# EAGLE design clockv2 (EAGLE 6.4)
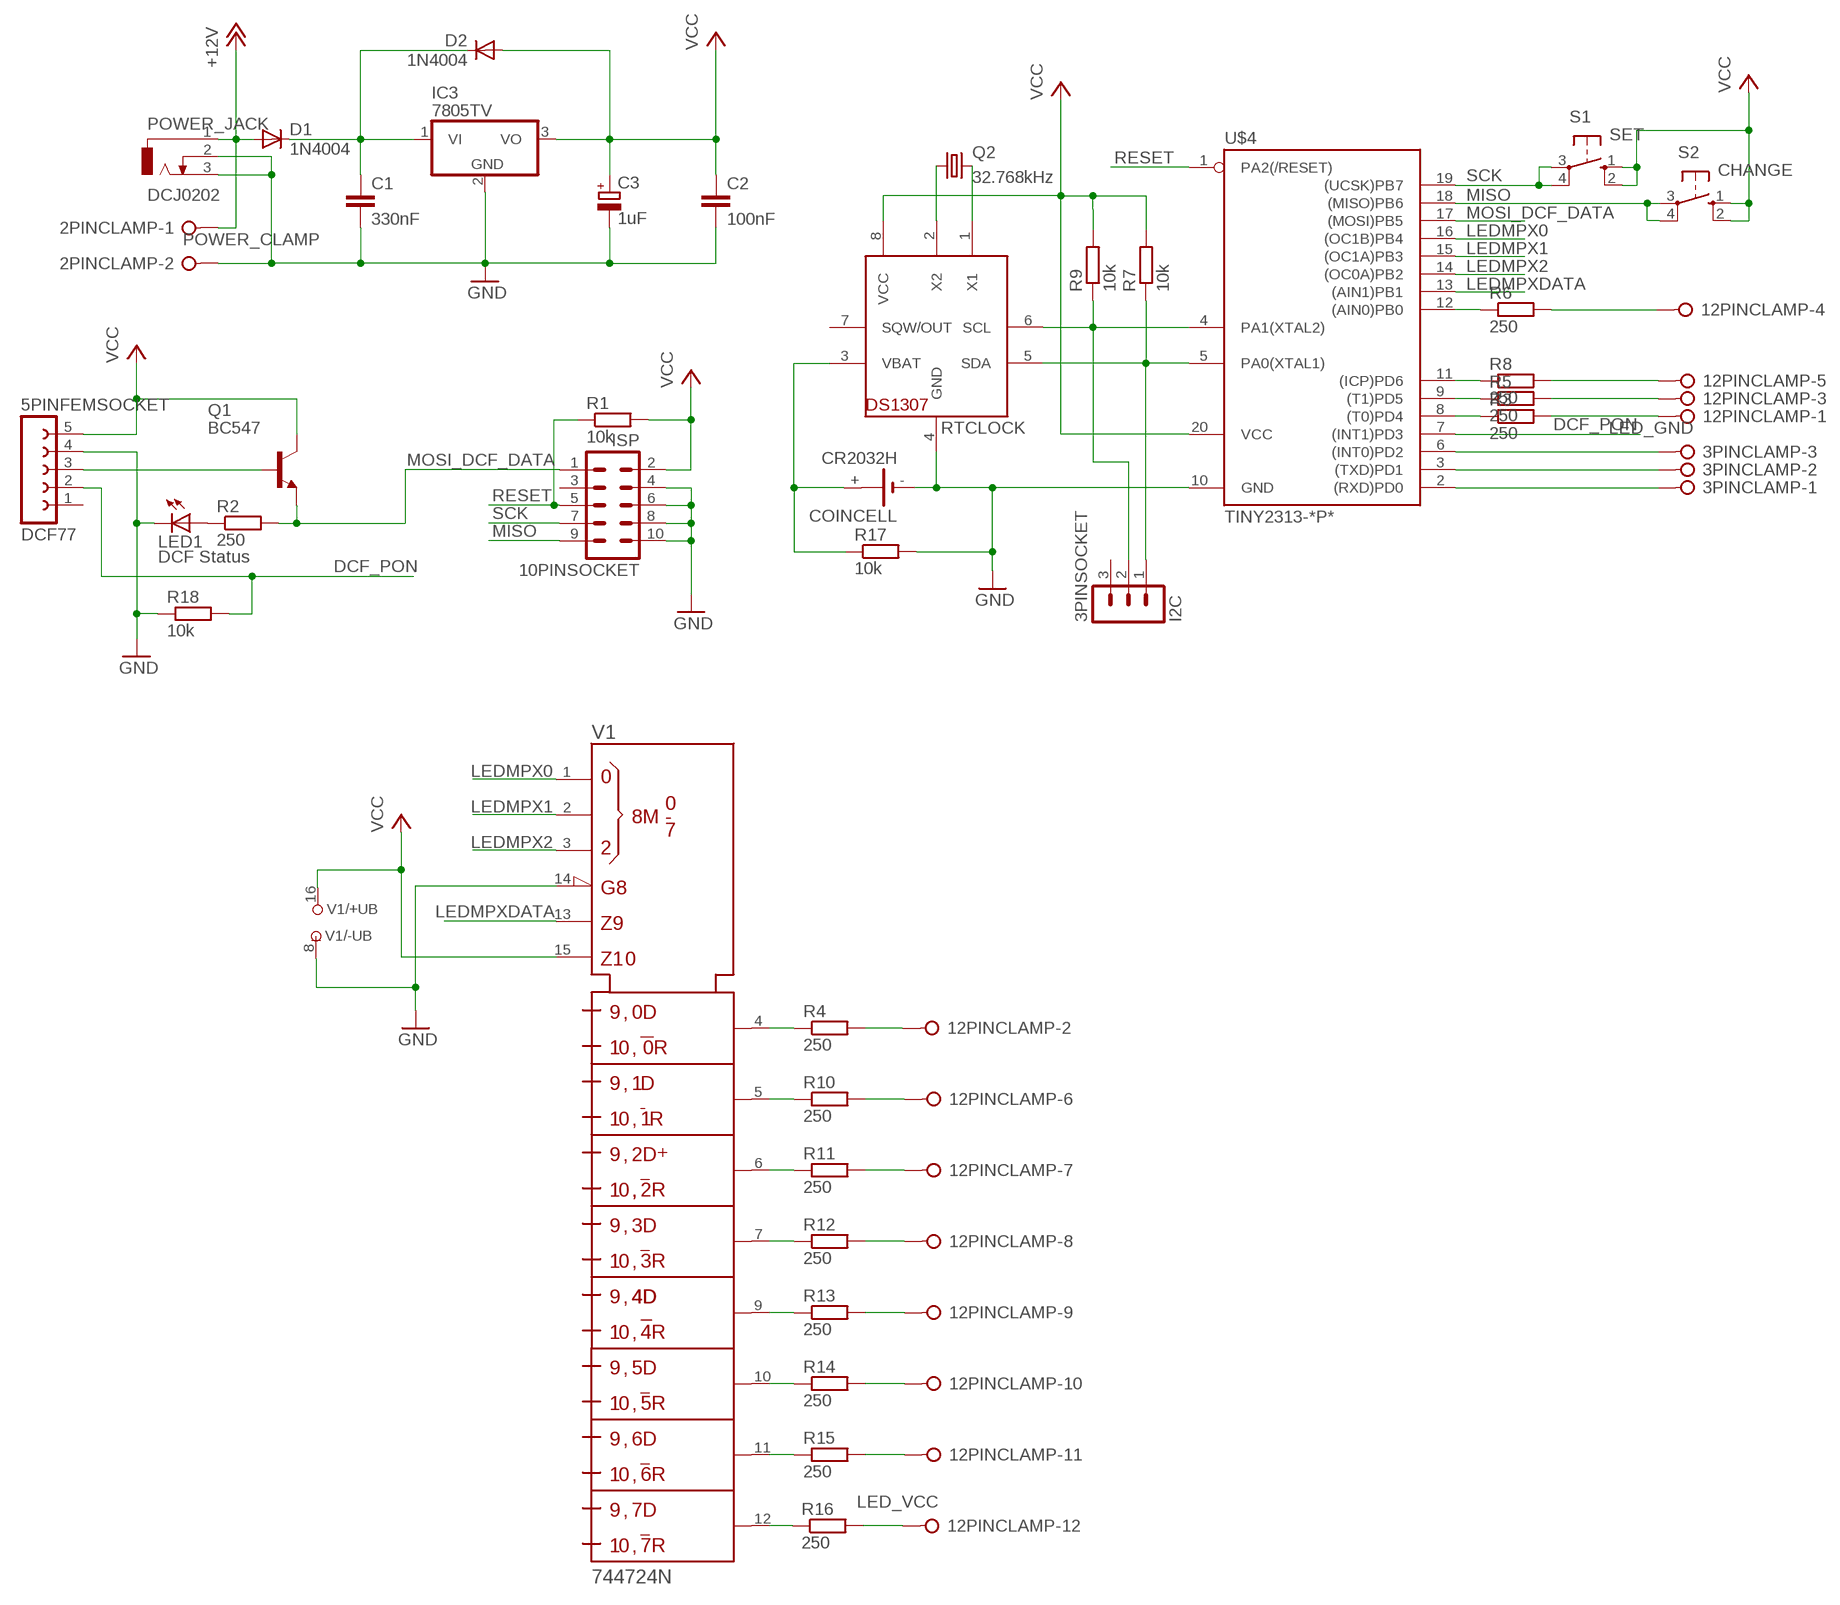
[diagram p0: schematic, sheet 1]

## Parts
2PINCLAMP  POWER_CLAMP  W237-02P  [W237-132]
3PINCLAMP  LED_GND  W237-03P  [W237-133]
3PINSOCKET  I2C  MA03-1  [MA03-1]
5PINFEMSOCKET  DCF77  FE05-1  [FE05-1]
10PINSOCKET  ISP  ML10  [ML10]
12PINCLAMP  LED_VCC  W237-12P  [W237-12P]
C1  330nF  C-EU050-025X075  [C050-025X075]
C2  100nF  C-EU050-025X075  [C050-025X075]
C3  1uF  CPOL-EUE2-4  [E2-4]
COINCELL  CR2032H  [CR2032H]
D1  1N4004  [DO41-10]
D2  1N4004  [DO41-10]
IC3  7805TV  [TO220V]
LED1  DCF Status  LED5MM  [LED5MM]
POWER_JACK  DCJ0202  [DCJ0202]
Q1  BC547  [TO92]
Q2  32.768kHz  CRYSTALTC38H  [TC38H]
R1  10k  R-EU_0204/5  [0204/5]
R2  250  R-EU_0204/5  [0204/5]
R3  250  R-EU_0204/5  [0204/5]
R4  250  R-EU_0204/5  [0204/5]
R5  250  R-EU_0204/5  [0204/5]
R6  250  R-EU_0204/5  [0204/5]
R7  10k  R-EU_0204/5  [0204/5]
R8  250  R-EU_0204/5  [0204/5]
R9  10k  R-EU_0204/5  [0204/5]
R10  250  R-EU_0204/5  [0204/5]
R11  250  R-EU_0204/5  [0204/5]
R12  250  R-EU_0204/5  [0204/5]
R13  250  R-EU_0204/5  [0204/5]
R14  250  R-EU_0204/5  [0204/5]
R15  250  R-EU_0204/5  [0204/5]
R16  250  R-EU_0204/5  [0204/5]
R17  10k  R-EU_0204/5  [0204/5]
R18  10k  R-EU_0204/5  [0204/5]
RTCLOCK  DS1307  [DIL08]
S1  SET  10-XX  [B3F-10XX]
S2  CHANGE  10-XX  [B3F-10XX]
U$4  TINY2313-*P*  [DIL20]
V1  744724N  [DIL16]

## Nets
+12V: 2PINCLAMP.1 D1.A POWER_JACK.1
DCF_PON: 5PINFEMSOCKET.2 R18.2 U$4.7((INT1)PD3)
GND: 2PINCLAMP.2 5PINFEMSOCKET.4 10PINSOCKET.4 10PINSOCKET.6 10PINSOCKET.8 10PINSOCKET.10 C1.2 C2.2 C3.- COINCELL.- IC3.2(GND) LED1.K(C) POWER_JACK.2 POWER_JACK.3 R17.2 R18.1 RTCLOCK.4(GND) U$4.10(GND) V1.8(-UB) V1.14(!G)
LEDMPX0: U$4.16((OC1B)PB4) V1.1(S0)
LEDMPX1: U$4.15((OC1A)PB3) V1.2(S1)
LEDMPX2: U$4.14((OC0A)PB2) V1.3(S2)
LEDMPXDATA: U$4.13((AIN1)PB1) V1.13(D)
MISO: 10PINSOCKET.9 S2.3(P) S2.4(P1) U$4.18((MISO)PB6)
MOSI_DCF_DATA: 10PINSOCKET.1 Q1.1(E) R2.2 U$4.17((MOSI)PB5)
N$1: 12PINCLAMP.4 R6.2
N$2: 12PINCLAMP.2 R4.2
N$3: 12PINCLAMP.3 R5.2
N$4: 5PINFEMSOCKET.3 Q1.2(B)
N$5: 12PINCLAMP.1 R3.2
N$6: 12PINCLAMP.5 R8.2
N$7: 12PINCLAMP.6 R10.2
N$8: R5.1 U$4.9((T1)PD5)
N$9: R10.1 V1.5(Q1)
N$10: 12PINCLAMP.9 R13.2
N$11: 12PINCLAMP.10 R14.2
N$12: 12PINCLAMP.11 R15.2
N$13: 12PINCLAMP.12 R16.2
N$14: R3.1 U$4.8((T0)PD4)
N$15: R4.1 V1.4(Q0)
N$16: LED1.A R2.1
N$17: C1.1 D1.C D2.C IC3.1(VI)
N$18: R6.1 U$4.12((AIN0)PB0)
N$19: R8.1 U$4.11((ICP)PD6)
N$20: 12PINCLAMP.8 R12.2
N$21: 12PINCLAMP.7 R11.2
N$22: R11.1 V1.6(Q2)
N$23: R12.1 V1.7(Q3)
N$24: R16.1 V1.12(Q7)
N$25: R13.1 V1.9(Q4)
N$26: R14.1 V1.10(Q5)
N$27: R15.1 V1.11(Q6)
N$28: 3PINCLAMP.3 U$4.6((INT0)PD2)
N$29: 3PINCLAMP.2 U$4.3((TXD)PD1)
N$30: 3PINCLAMP.1 U$4.2((RXD)PD0)
N$31: 3PINSOCKET.2 R9.1 RTCLOCK.6(SCL) U$4.4(PA1(XTAL2))
N$32: 3PINSOCKET.1 R7.1 RTCLOCK.5(SDA) U$4.5(PA0(XTAL1))
N$33: COINCELL.+ R17.1 RTCLOCK.3(VBAT)
N$34: Q2.1 RTCLOCK.2(X2)
N$35: Q2.2 RTCLOCK.1(X1)
RESET: 10PINSOCKET.5 R1.1 U$4.1(PA2(/RESET))
SCK: 10PINSOCKET.7 S1.3(P) S1.4(P1) U$4.19((UCSK)PB7)
VCC: 5PINFEMSOCKET.5 10PINSOCKET.2 C2.1 C3.+ D2.A IC3.3(VO) Q1.3(C) R1.2 R7.2 R9.2 RTCLOCK.8(VCC) S1.1(S) S1.2(S1) S2.1(S) S2.2(S1) U$4.20(VCC) V1.15(CLR) V1.16(+UB)
Unconnected: 3PINSOCKET.3 5PINFEMSOCKET.1 10PINSOCKET.3 COINCELL.+@1(+) RTCLOCK.7(SQW/OUT)

## Library data of the parts
2PINCLAMP = con-wago-508:W237-02P: WAGO SREW CLAMP; OC_FARNELL: unknown; OC_NEWARK: unknown
3PINCLAMP = con-wago-508:W237-03P: WAGO SREW CLAMP; OC_FARNELL: unknown; OC_NEWARK: unknown
3PINSOCKET = con-lstb:MA03-1: PIN HEADER; OC_FARNELL: unknown; OC_NEWARK: unknown
5PINFEMSOCKET = con-lsta:FE05-1: FEMALE HEADER; OC_FARNELL: unknown; OC_NEWARK: unknown
10PINSOCKET = con-harting-ml:ML10: HARTING; OC_FARNELL: unknown; OC_NEWARK: unknown
12PINCLAMP = con-wago-508:W237-12P: WAGO SREW CLAMP; OC_FARNELL: unknown; OC_NEWARK: unknown
C1 C2 = rcl:C-EU: CAPACITOR, European symbol
C3 = rcl:CPOL-EU: POLARIZED CAPACITOR, European symbol
COINCELL = battery:CR2032H: LI BATTERY Varta
D1 D2 = diode:1N4004: DIODE general purpose rectifier, 1 A
IC3 = linear:78*: Positive VOLTAGE REGULATOR Source: http://cache.national.com/ds/LM/LM78L05.pdf http://www.fairchildsemi.com/ds/LM/LM7805.pdf
LED1 = led:LED: LED OSRAM: - CHIPLED LG R971, LG N971, LY N971, LG Q971, LY Q971, LO R971, LY R971 LH N974, LH R974 LS Q976, LO Q976, LY Q976 LO Q996 - Hyper CHIPLED LW Q18S LB Q993, LB Q99A, LB R99A - SideLED LS A670, LO A670, LY A670, LG A670, LP A670 LB A673, LV A673, LT A673, LW A673 LH A674 LY A675 LS A676, LA A676, LO A676, LY A676, LW A676 LS A679, LY A679, LG A679 - Hyper Micro SIDELED® LS Y876, LA Y876, LO Y876, LY Y876 LT Y87S - SmartLED LW L88C, LW L88S LB L89C, LB L89S, LG L890 LS L89K, LO L89K, LY L89K LS L896, LA L896, LO L896, LY L896 - TOPLED LS T670, LO T670, LY T670, LG T670, LP T670 LSG T670, LSP T670, LSY T670, LOP T670, LYG T670 LG T671, LOG T671, LSG T671 LB T673, LV T673, LT T673, LW T673 LH T674 LS T676, LA T676, LO T676, LY T676, LB T676, LH T676, LSB T676, LW T676 LB T67C, LV T67C, LT T67C, LS T67K, LO T67K, LY T67K, LW E67C LS E67B, LA E67B, LO E67B, LY E67B, LB E67C, LV E67C, LT E67C LW T67C LS T679, LY T679, LG T679 LS T770, LO T770, LY T770, LG T770, LP T770 LB T773, LV T773, LT T773, LW T773 LH T774 LS E675, LA E675, LY E675, LS T675 LS T776, LA T776, LO T776, LY T776, LB T776 LHGB T686 LT T68C, LB T68C - Hyper Mini TOPLED® LB M676 - Mini TOPLED Santana® LG M470 LS M47K, LO M47K, LY M47K Source: http://www.osram.convergy.de LUXEON: - LUMILED® LXK2-PW12-R00, LXK2-PW12-S00, LXK2-PW14-U00, LXK2-PW14-V00 LXK2-PM12-R00, LXK2-PM12-S00, LXK2-PM14-U00 LXK2-PE12-Q00, LXK2-PE12-R00, LXK2-PE12-S00, LXK2-PE14-T00, LXK2-PE14-U00 LXK2-PB12-K00, LXK2-PB12-L00, LXK2-PB12-M00, LXK2-PB14-N00, LXK2-PB14-P00, LXK2-PB14-Q00 LXK2-PR12-L00, LXK2-PR12-M00, LXK2-PR14-Q00, LXK2-PR14-R00 LXK2-PD12-Q00, LXK2-PD12-R00, LXK2-PD12-S00 LXK2-PH12-R00, LXK2-PH12-S00 LXK2-PL12-P00, LXK2-PL12-Q00, LXK2-PL12-R00 Source: www.luxeon.com KINGBRIGHT: KA-3528ASYC Source: www.kingbright.com
POWER_JACK = con-jack:DCJ0202: DC POWER JACK Source: DCJ0202.pdf; OC_FARNELL: unknown; OC_NEWARK: unknown
Q1 = transistor-npn:BC547*: NPN Transistor
Q2 = crystal:CRYSTAL: CRYSTAL; OC_FARNELL: unknown; OC_NEWARK: unknown
R1-R18 = resistor:R-EU_: RESISTOR, European symbol
RTCLOCK = adafruit:DS1307: DS1307 Real time clock (RTC) with battery backup ability. Talk to it via i2c
S1 S2 = switch-omron:10-XX: OMRON SWITCH; MPN: B3F-1000; OC_FARNELL: 176432; OC_NEWARK: 36M3542
U$4 = avr-6:TINY2313*: Atmel Tiny2313 2K Flash, 128 bytes EEPROM, 128 bytes RAM
V1 = 74ttl-din:74*4724: 8 Bit Addressable LATCH

## Board
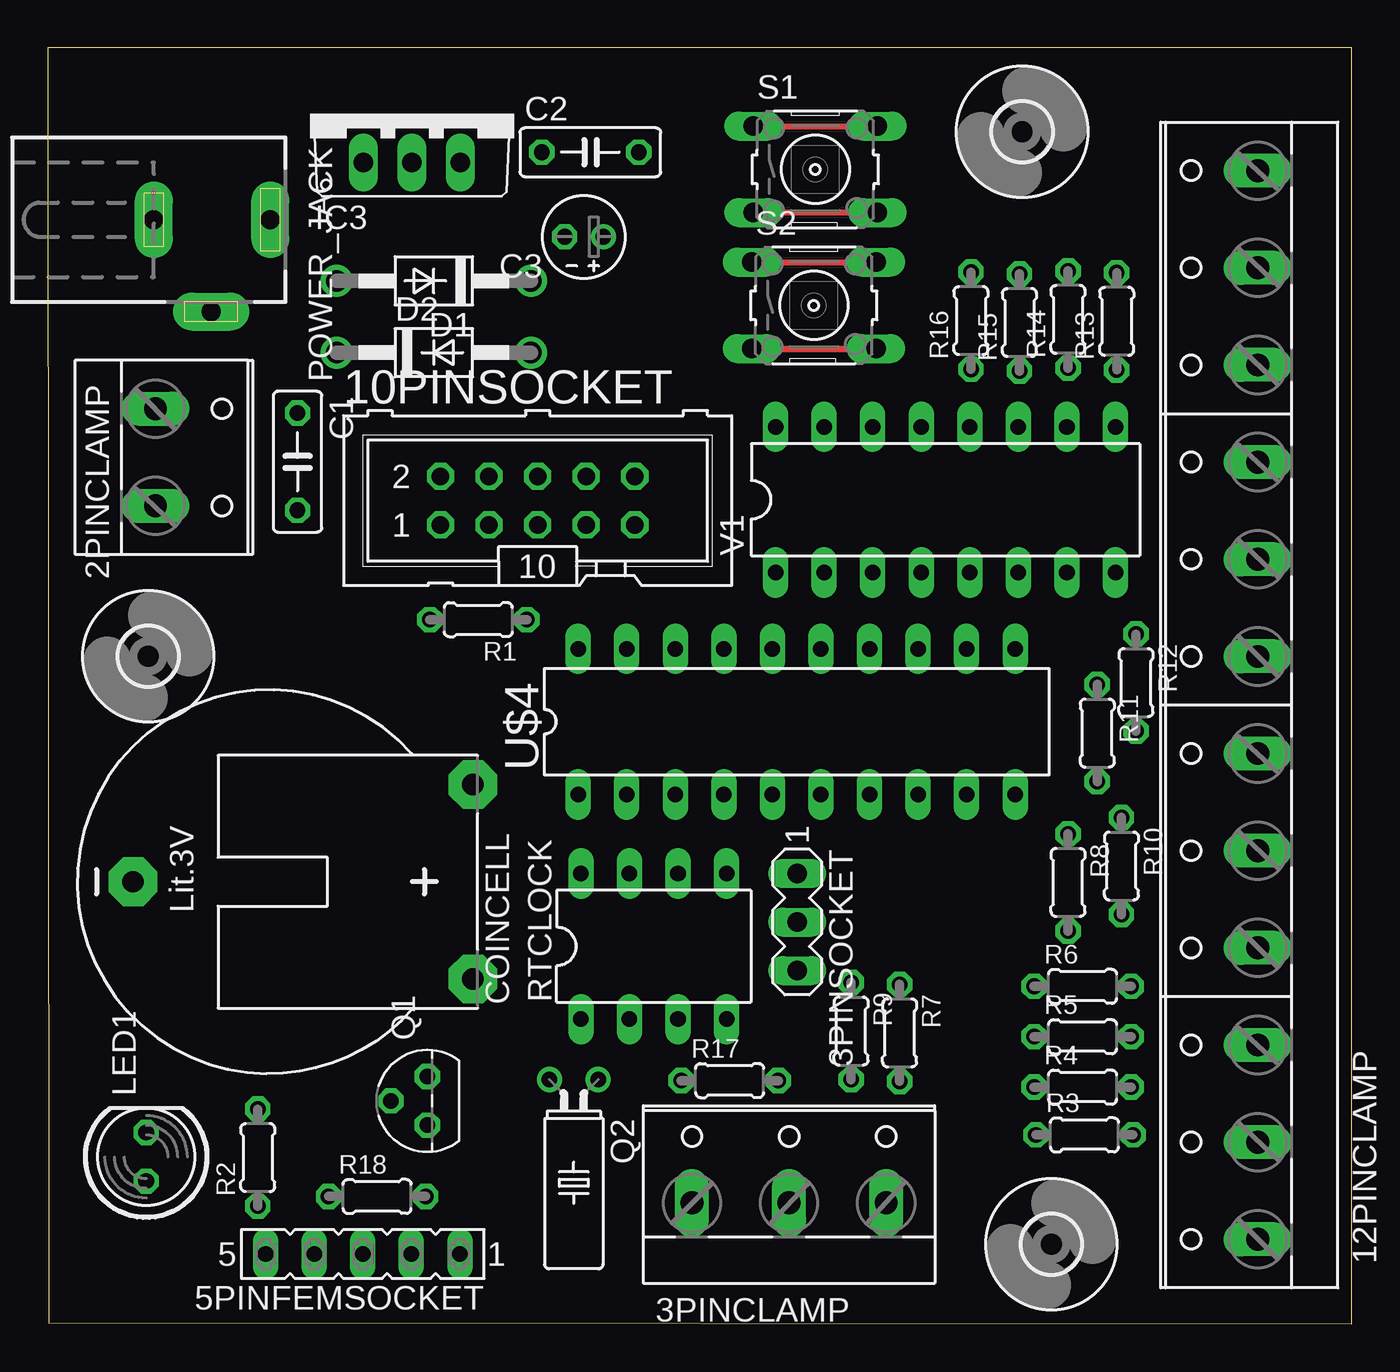
[diagram p1: board, top side]
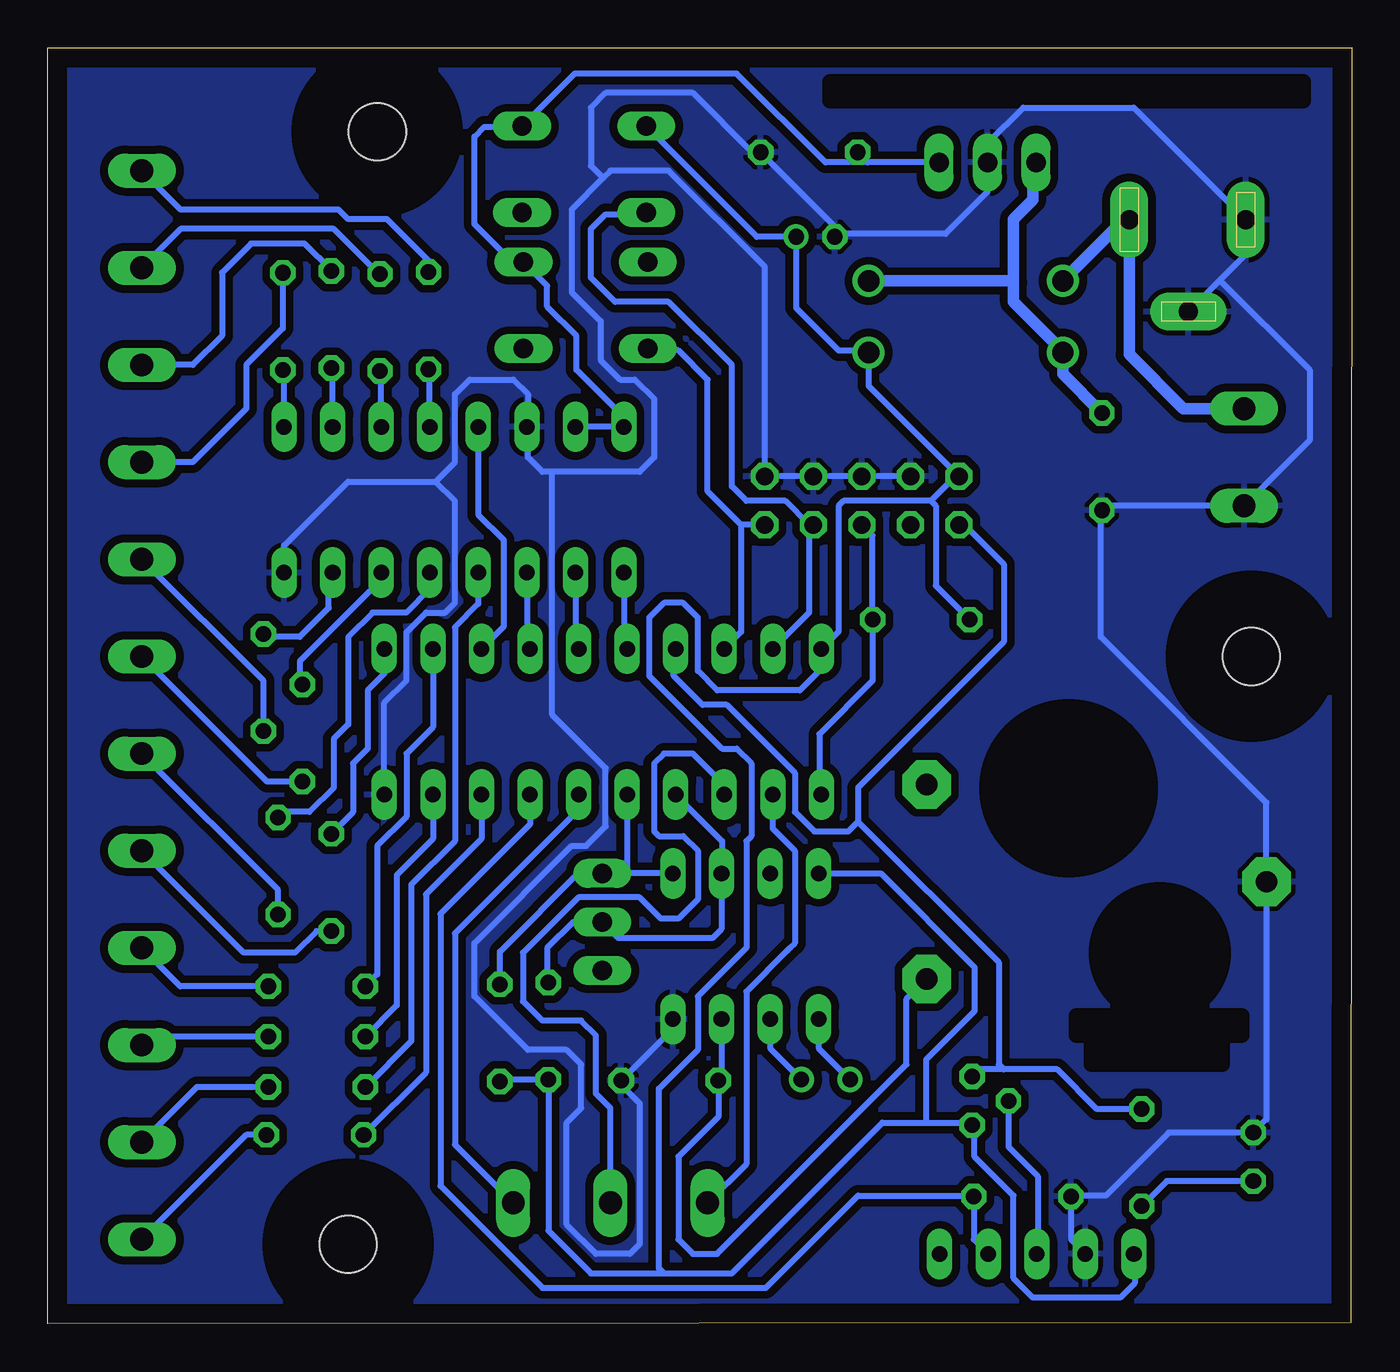
[diagram p2: board, bottom side, seen from below]

Size 68.21 x 66.73 mm. Coordinates in mm from the lower left corner, seen from the top.
Outline: 0.05,0.05 68.21,0 68.21,66.73 0,66.73 0.05,0.05
Copper layers (1*16): Top 0.035mm / dielectric 1.5mm / Bottom 0.035mm
Design rules "default *": minimum track width 12mil, minimum drill 30mil, track to track 12mil, track to pad 12mil, pad to pad 12mil, via to via 12mil, smd to smd 8mil, copper to edge 40mil, drill to drill 12mil, minimum pad ring 10mil, minimum via ring 10mil, stop-mask expansion 4mil, vias tented up to drill 0mil, thermal gap 10mil
bRestrict: area 8.5,17.9 to 11.6,20.9; area 12.8,26 to 16.8,30; area 2.5,64 to 27.3,65; area 5.8,15.1 to 14.4,16.1; area 6.8,13.6 to 13.6,14.8

### Footprints (pad centres in the part's own frame; a part is rotated, then mirrored left to right if it is on the bottom)
W237-132 = drill 1.194 long: 1 -2.54,-0.635; 2 2.54,-0.635
W237-133 = drill 1.194 long: 1 -5.08,-0.635; 2 0,-0.635; 3 5.08,-0.635
MA03-1 = drill 1.016 long: 1 -2.54,0; 2 0,0; 3 2.54,0
FE05-1 = drill 0.813 long: 1 -5.08,0; 2 -2.54,0; 3 0,0; 4 2.54,0; 5 5.08,0
ML10 = drill 0.914 octagon: 1 -5.08,-1.27; 2 -5.08,1.27; 3 -2.54,-1.27; 4 -2.54,1.27; 5 0,-1.27; 6 0,1.27; 7 2.54,-1.27; 8 2.54,1.27; 9 5.08,-1.27; 10 5.08,1.27
W237-12P = drill 1.194 long: 1 -27.94,-0.635; 2 -22.86,-0.635; 3 -17.78,-0.635; 4 -12.7,-0.635; 5 -7.62,-0.635; 6 -2.54,-0.635; 7 2.54,-0.635; 8 7.62,-0.635; 9 12.7,-0.635; 10 17.78,-0.635; 11 22.86,-0.635; 12 27.94,-0.635
C050-025X075 = drill 0.813 octagon: 1 -2.54,0; 2 2.54,0
E2-4 = drill 0.813 pad 1.27: + -1.016,0 | drill 0.813 pad 1.27 octagon: - 1.016,0
CR2032H = drill 1.118 pad 2.54 octagon: + 5.08,10.795; +@1 -5.08,10.795; - 0,-6.985
DO41-10 = drill 1.118: A 5.08,0; C -5.08,0
TO220V = drill 1.016 long: 1 -2.54,-2.54; 2 0,-2.54; 3 2.54,-2.54
LED5MM = drill 0.813 octagon: A -1.27,0; K 1.27,0
DCJ0202 = drill 1 pad 2 long: 1 0,3.1; 2 4.8,0; 3 0,-3
TO92 = drill 0.813 octagon: 1 1.27,0; 2 0,1.905; 3 -1.27,0
TC38H = drill 0.813: 1 -1.27,0; 2 1.27,0
0204/5 = drill 0.813 octagon: 1 -2.54,0; 2 2.54,0
DIL08 = drill 0.813 long: 1 -3.81,-3.81; 2 -1.27,-3.81; 3 1.27,-3.81; 4 3.81,-3.81; 5 3.81,3.81; 6 1.27,3.81; 7 -1.27,3.81; 8 -3.81,3.81
B3F-10XX = drill 1.016 long: 1 -3.251,2.261; 2 3.251,2.261; 3 -3.251,-2.261; 4 3.251,-2.261
3,0 = hole 3: 0,0
DIL20 = drill 0.813 long: 1 -11.43,-3.81; 2 -8.89,-3.81; 3 -6.35,-3.81; 4 -3.81,-3.81; 5 -1.27,-3.81; 6 1.27,-3.81; 7 3.81,-3.81; 8 6.35,-3.81; 9 8.89,-3.81; 10 11.43,-3.81; 11 11.43,3.81; 12 8.89,3.81; 13 6.35,3.81; 14 3.81,3.81; 15 1.27,3.81; 16 -1.27,3.81; 17 -3.81,3.81; 18 -6.35,3.81; 19 -8.89,3.81; 20 -11.43,3.81
DIL16 = drill 0.813 long: 1 -8.89,-3.81; 2 -6.35,-3.81; 3 -3.81,-3.81; 4 -1.27,-3.81; 5 1.27,-3.81; 6 3.81,-3.81; 7 6.35,-3.81; 8 8.89,-3.81; 9 8.89,3.81; 10 6.35,3.81; 11 3.81,3.81; 12 1.27,3.81; 13 -1.27,3.81; 14 -3.81,3.81; 15 -6.35,3.81; 16 -8.89,3.81

### Placement (x,y rotation side)
2PINCLAMP  6.26,45.32 270 top
3PINCLAMP  38.78,6.97 0 top
3PINSOCKET  39.19,21.02 270 top
5PINFEMSOCKET  16.48,3.66 180 top
10PINSOCKET  25.62,43.05 0 top
12PINCLAMP  62.65,32.37 90 top
C1  13.06,45.09 270 top
C2  28.38,61.27 0 top
C3  28.05,56.85 180 top
COINCELL  11.44,23.12 270 top
D1  20.19,54.54 180 top
D2  20.19,50.79 0 top
IC3  19.05,63.28 0 top
LED1  5.15,8.74 90 top
POWER_JACK  8.54,57.74 270 top
Q1  19.86,11.67 90 top
Q2  27.51,12.78 180 top
R1  22.52,36.83 180 top
R2  10.98,8.7 90 top
R3  54.23,9.89 0 top
R4  54.13,12.39 0 top
R5  54.13,15.02 0 top
R6  54.13,17.66 0 top
R7  44.56,15.22 270 top
R8  53.37,23.09 270 top
R9  42.02,15.32 270 top
R10  56.16,23.95 270 top
R11  54.89,30.9 270 top
R12  56.92,33.54 270 top
R13  55.91,52.43 90 top
R14  53.37,52.52 90 top
R15  50.83,52.37 90 top
R16  48.29,52.46 90 top
R17  35.67,12.73 0 top
R18  17.23,6.67 0 top
RTCLOCK  31.7,19.75 0 top
S1  40.15,60.37 0 top
S2  40.07,53.26 0 top
U$1  [3,0]  50.97,62.34 0 top
U$2  [3,0]  52.49,4.17 0 top
U$3  [3,0]  5.25,34.91 0 top
U$4  39.17,31.49 0 top
V1  46.96,43.1 0 top

### Tracks (layer width: path | path; a pad name or v marks a point on that pad's centre or on a via)
+12V
  Bottom 0.305: POWER_JACK.1 11.91,57.74
  Bottom 0.61: 11.91,57.74 D1.A | POWER_JACK.1 11.64,50.7 8.8,47.86 2PINCLAMP.1
DCF_PON
  Bottom 0.305: U$4.7 42.98,26.13 47.67,21.44 47.67,7.22 42.33,1.89 30.65,1.89 25.82,6.71 19.81,6.71 R18.2 19.77,4.41 5PINFEMSOCKET.2
GND
  Bottom 0.305: 6.87,54.61 5.54,55.94 POWER_JACK.3 11.41,63.61 17.19,63.61 19.05,61.74 IC3.2 19.05,59.2 21.25,57 26.88,57 C3.- 27.03,57.38 C2.2 31.36,61.27 34.46,64.37 39.03,64.37 39.79,63.61 39.79,60.56 39.16,59.92 | 6.87,54.61 POWER_JACK.2 | 10PINSOCKET.4 10PINSOCKET.6 10PINSOCKET.8 10PINSOCKET.10 30.7,55.28 35.73,60.31 38.78,60.31 39.16,59.92 | V1.8 55.85,40.7 52.49,44.05 47.92,44.05 | 47.92,44.05 46.9,45.07 46.9,48.62 46.14,49.38 43.86,49.38 43.09,48.62 43.09,46.96 V1.14 43.09,46.86 43.09,45.32 42.33,44.56 41.82,44.56 | 39.16,59.92 40.81,58.27 40.81,53.96 39.28,52.43 39.28,50.4 38.27,49.38 37.51,49.38 36.49,48.37 36.49,45.32 37.25,44.56 41.82,44.56 | 6.87,54.61 6.87,54.56 2.2,49.89 2.2,46.21 2PINCLAMP.2 12.83,42.78 C1.2 13.12,42.49 13.12,35.92 4.46,27.26 COINCELL.- 4.46,10.7 LED1.K 9.57,10.01 12.87,6.71 14.64,6.71 R18.1 14.69,4.41 5PINFEMSOCKET.4 | RTCLOCK.4 35.51,15.43 R17.2 38.21,12.5 37.25,11.54 37.25,4.17 37.76,3.66 39.54,3.66 41.06,5.19 41.06,10.52 40.3,11.28 40.3,13.57 41.06,14.33 43.09,14.33 45.89,17.13 45.89,19.92 40.81,25 40.05,25 39.03,26.02 39.03,29.06 41.82,31.86 41.82,44.56 | U$4.10 50.6,32.48 49.44,33.64 49.44,36.18 48.43,37.19 47.41,37.19 46.9,37.7 46.9,43.03 47.92,44.05
  pour Bottom (isolate 0.406): 0.17,66.4 67.99,66.4 67.99,0.36 0.32,0.31
LEDMPX0
  Bottom 0.305: V1.1 38.07,35.47 U$4.16
LEDMPX1
  Bottom 0.305: V1.2 40.61,35.47 U$4.15
LEDMPX2
  Bottom 0.305: V1.3 43.15,35.47 U$4.14
LEDMPXDATA
  Bottom 0.305: V1.13 45.69,42.32 44.36,41 44.36,36.46 U$4.13
MISO
  Top 0.305: S2.3 S2.4
  Bottom 0.305: 10PINSOCKET.9 31.94,41.78 | 31.94,41.78 33.7,43.54 33.7,49.38 35.22,50.91 36.73,50.91 S2.3 | 31.94,41.78 31.94,36.19 U$4.18
MOSI_DCF_DATA
  Bottom 0.305: U$4.17 35.47,35.19 35.47,33.89 33.95,32.37 32.68,32.37 29.12,28.81 29.12,26.78 28.11,25.76 26.33,25.76 25.82,26.27 | R2.2 13.33,11.24 15.41,13.32 18.2,13.32 | 18.2,13.32 19.48,13.32 | 19.48,13.32 Q1.1 | 10PINSOCKET.1 20.25,41.78 18.2,39.73 18.2,35.67 25.82,28.05 25.82,26.27 | 19.47,13.32 19.48,13.32 | 25.82,26.27 18.46,18.9 18.46,13.57 18.2,13.32
N$1
  Bottom 0.305: R6.2 61.28,17.66 12PINCLAMP.4
N$2
  Bottom 0.305: R4.2 60.41,12.39 12PINCLAMP.2
N$3
  Bottom 0.305: R5.2 62.85,15.02 12PINCLAMP.3
N$4
  Bottom 0.305: Q1.2 17.95,9.26 16.42,7.73 16.42,3.71 5PINFEMSOCKET.3
N$5
  Bottom 0.305: R3.2 57.83,9.89 12PINCLAMP.1
N$6
  Bottom 0.305: R8.2 54.15,20.55 55.29,19.41 57.95,19.41 12PINCLAMP.5
N$7
  Bottom 0.305: R10.2 56.16,22.7 12PINCLAMP.6
N$8
  Bottom 0.305: U$4.9 48.06,25.37 49.95,23.48 49.95,16.66 R5.1
N$9
  Bottom 0.305: V1.5 48.23,38.41 49.44,37.19 51.22,37.19 52.49,35.92 52.49,31.35 53.25,30.59 53.25,28.05 54.52,26.78 55.87,26.78 R10.1
N$10
  Bottom 0.305: R13.2 55.91,52.06 57.83,50.15 57.83,47.86 60.62,45.07 12PINCLAMP.9
N$11
  Bottom 0.305: R14.2 53.37,55.09 54.78,56.5 57.57,56.5 59.1,54.97 59.1,51.67 60.62,50.15 12PINCLAMP.10
N$12
  Bottom 0.305: R15.2 50.9,54.91 53.25,57.26 61.26,57.26 12PINCLAMP.11
N$13
  Bottom 0.305: R16.2 48.29,55.59 50.46,57.77 52.49,57.77 53,58.27 61.26,58.27 12PINCLAMP.12
N$14
  Bottom 0.305: U$4.8 45.52,25.37 48.43,22.46 48.43,13.15 R3.1
N$15
  Bottom 0.305: V1.4 45.69,37.65 46.9,36.43 46.9,25.25 49.19,22.97 49.19,14.79 R4.1
N$16
  Bottom 0.305: LED1.A 9.67,7.47 R2.1
N$17
  Bottom 0.305: 17.77,54.54 17.69,54.46 | D2.C 15.11,50.86
  Bottom 0.61: IC3.1 16.68,60.57 16.68,58.78 17.69,57.77 17.69,54.46 17.69,53.45 15.11,50.86 | D1.C 17.77,54.54 | D2.C 15.11,49.67 C1.1
N$18
  Bottom 0.305: U$4.12 48.06,31.21 49.44,29.83 49.44,26.52 50.97,25 50.97,18.28 R6.1
N$19
  Bottom 0.305: U$4.11 50.6,34 51.48,33.13 51.48,30.08 52.24,29.32 52.24,26.76 R8.1
N$20
  Bottom 0.305: R12.2 56.92,33.62 12PINCLAMP.8
N$21
  Bottom 0.305: R11.2 56.74,28.36 12PINCLAMP.7
N$22
  Bottom 0.305: V1.6 50.77,38.66 51.02,38.66 55.03,34.65 55.03,33.58 R11.1
N$23
  Bottom 0.305: V1.7 53.51,39.09 53.51,37.45 55.03,35.92 56.77,35.92 R12.1
N$24
  Bottom 0.305: V1.12 48.23,49.86 R16.1
N$25
  Bottom 0.305: V1.9 55.85,49.83 R13.1
N$26
  Bottom 0.305: V1.10 53.31,49.92 R14.1
N$27
  Bottom 0.305: V1.11 50.77,49.76 R15.1
N$28
  Bottom 0.305: 3PINCLAMP.3 46.9,9.38 46.9,20.43 40.44,26.89 U$4.6
N$29
  Bottom 0.305: U$4.3 32.82,28.19 34.46,29.83 35.98,29.83 36.49,29.32 36.49,25.76 36.24,25.51 34.97,25.51 34.2,24.75 34.2,22.21 35.22,21.19 36.13,21.19 37.25,22.31 40.45,22.31 43.35,19.41 43.35,16.87 42.33,15.86 40.3,15.86 39.54,15.09 39.54,12.05 38.78,11.28 3PINCLAMP.2
N$30
  Bottom 0.305: 3PINCLAMP.1 31.66,8.36 31.66,17.38 29.5,19.54 29.38,19.67 29.12,19.92 29.12,24.75 30.28,25.9 U$4.2
N$31
  Bottom 0.305: R9.1 42.08,17.91 42.08,19.67 40.73,21.02 3PINSOCKET.2 38.35,20.17 33.44,20.17 32.97,20.65 RTCLOCK.6 32.93,23.59 32.93,25.25 U$4.4
N$32
  Bottom 0.305: RTCLOCK.5 37.76,23.56 | 37.76,23.56 3PINSOCKET.1 39.37,23.73 40.3,23.73 44.56,19.47 R7.1 | U$4.5 37.9,23.7 37.76,23.56
N$33
  Bottom 0.305: RTCLOCK.3 32.97,12.89 R17.1 33.13,10.83 35.22,8.74 35.22,4.43 34.46,3.66 33.19,3.66 23.28,13.57 23.28,17 COINCELL.+
N$34
  Bottom 0.305: RTCLOCK.2 30.43,14.42 Q2.1
N$35
  Bottom 0.305: RTCLOCK.1 27.89,14.42 Q2.2
RESET
  Bottom 0.305: 25.57,41.73 10PINSOCKET.5 25.06,41.22 R1.1 25.06,33.64 27.85,30.84 27.85,27.79 U$4.1
SCK
  Top 0.305: S1.4 S1.3
  Bottom 0.305: 10PINSOCKET.7 28.38,41.78 | 28.38,41.78 29.63,43.03 31.66,43.03 32.43,43.8 32.43,50.15 35.73,53.45 38.52,53.45 39.79,54.72 39.79,57.26 39.03,58.02 36.99,58.02 S1.3 | 28.38,41.78 28.38,37.2 U$4.19
VCC
  Top 0.305: S1.1 S1.2 | S2.1 S2.2
  Bottom 0.305: IC3.3 25.31,60.74 | 25.31,60.74 C2.1 | V1.15 V1.16 38.07,47.4 40.55,49.89 40.55,51.67 42.08,53.19 42.08,54.28 S2.2 43.9,55.52 45.89,57.51 45.89,62.08 45.38,62.59 43.44,62.59 S1.2 40.65,65.39 32.17,65.39 27.53,60.74 25.31,60.74 | 22.01,43.03 20.72,44.32 10PINSOCKET.2 25.27,49.05 D2.A 25.38,50.91 26.84,50.91 29.07,53.14 C3.+ 31.11,56.85 S1.1 | 22.01,43.03 26.58,43.03 26.84,42.78 26.84,36.21 U$4.20 27.74,34.26 28.87,33.13 33.19,33.13 34.2,34.14 34.2,36.94 34.97,37.7 35.98,37.7 36.74,36.94 36.74,33.89 32.93,30.08 32.17,30.08 31.41,29.32 31.41,25.51 31.66,25.25 31.66,19.67 34.2,17.13 34.2,14.33 36.24,12.3 36.24,2.9 35.98,2.65 | 22.01,43.03 21.76,42.78 21.76,38.6 R1.2 | R7.2 44.46,12.78 R9.2 42.02,4.88 39.79,2.65 35.98,2.65 | 5PINFEMSOCKET.5 11.34,3.61 11.34,2.14 12.11,1.38 16.68,1.38 17.69,2.39 17.69,6.71 19.73,8.74 19.73,10.26 Q1.3 19.98,10.52 22.27,10.52 | 35.98,2.65 32.43,2.65 24.55,10.52 22.27,10.52 | RTCLOCK.8 24.63,23.56 19.73,18.65 19.73,16.36 22.27,13.82 22.27,10.52

### Text on the board
Document: BulbdialClock v2 Yomin@Netz39